# Altium schematic sheet ADC_MAX1037.SchDoc: MAX1037 ADC
size A4; Revision: 5; SheetNumber: 40; SheetTotal: 64; Organization: Altium Limited.; Address1: Level 3, 12a Rodborough Rd; Address2: Frenchs Forest 2086; Address3: NSW; Address4: AUSTRALIA
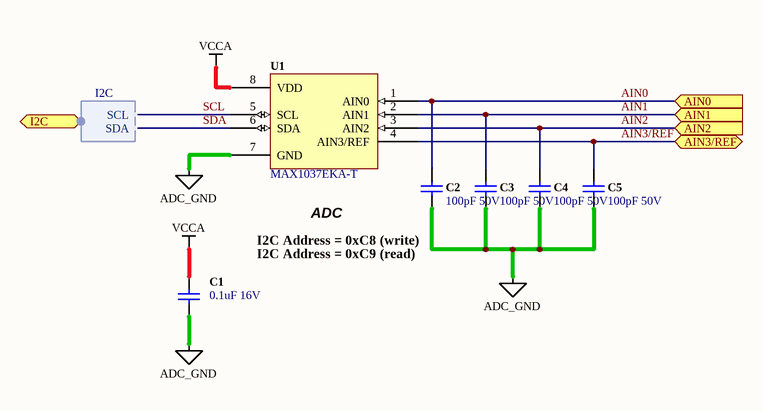
[diagram p0: ADC_MAX1037.SchDoc]

## Parts
C1  0.1uF 16V  [CAPC1005-STAR]
C2  100pF 50V  [CAPC1005-STAR]
C3  100pF 50V  [CAPC1005-STAR]
C4  100pF 50V  [CAPC1005-STAR]
C5  100pF 50V  [CAPC1005-STAR]
U1  MAX1037EKA-T  [SOT65P280-8]

## Ports
AIN0 (in), AIN1 (in), AIN2 (in), AIN3/REF, I2C (harness I2C)

## Harnesses
I2C: SCL, SDA

## Nets
ADC_GND: C1.2 C2.2 C3.2 C4.2 C5.2 U1.7(GND)
VCCA: C1.1 U1.8(VDD)
AIN0: C2.1 U1.1(AIN0) ; port AIN0
AIN1: C3.1 U1.2(AIN1) ; port AIN1
AIN2: C4.1 U1.3(AIN2) ; port AIN2
AIN3/REF: C5.1 U1.4(AIN3/REF) ; port AIN3/REF
SCL: U1.5(SCL) ; port I2C.SCL
SDA: U1.6(SDA) ; port I2C.SDA

## Notes on the sheet
- (near C2) I2C Address = 0xC8 (write)
- I2C Address = 0xC9 (read)
- (near U1) ADC
- Sheet Title
- Project Title
- Size:
- Date:
- A4
- Assy:
- Time:
- Sheet
- Revision:
- of
- File:

## Library data of the parts
C1 = D-101-0080: Capacitor, Ceramic, 0.1uF 10% 16V 0402 (1005) X7R; Polarity: Non-Polarized; Category: Capacitor; Capacitance: 0.1 uF; Dielectric: X7R; Mounting Technology: Surface Mount; Rated Voltage: 16 V; Status: Production; Technology: Ceramic; Tolerance: 10 %
C2-C5 = D-101-0078: Capacitor, Ceramic, 100pF 5% 50V 0402 (1005) COG; Polarity: Non-Polarized; Category: Capacitor; Capacitance: 100 pF; Dielectric: COG; Mounting Technology: Surface Mount; Rated Voltage: 50 V; Status: Production; Technology: Ceramic; Tolerance: 5 %
U1 = D-220-0000: MAX1037EKA-T, 2.7V to 5.5V, Low-Power, 4-Channel, I2C, 8-Bit ADCs; Category: IC-ADC; Status: Production